# EAGLE design playpad_hub (EAGLE 5.10)
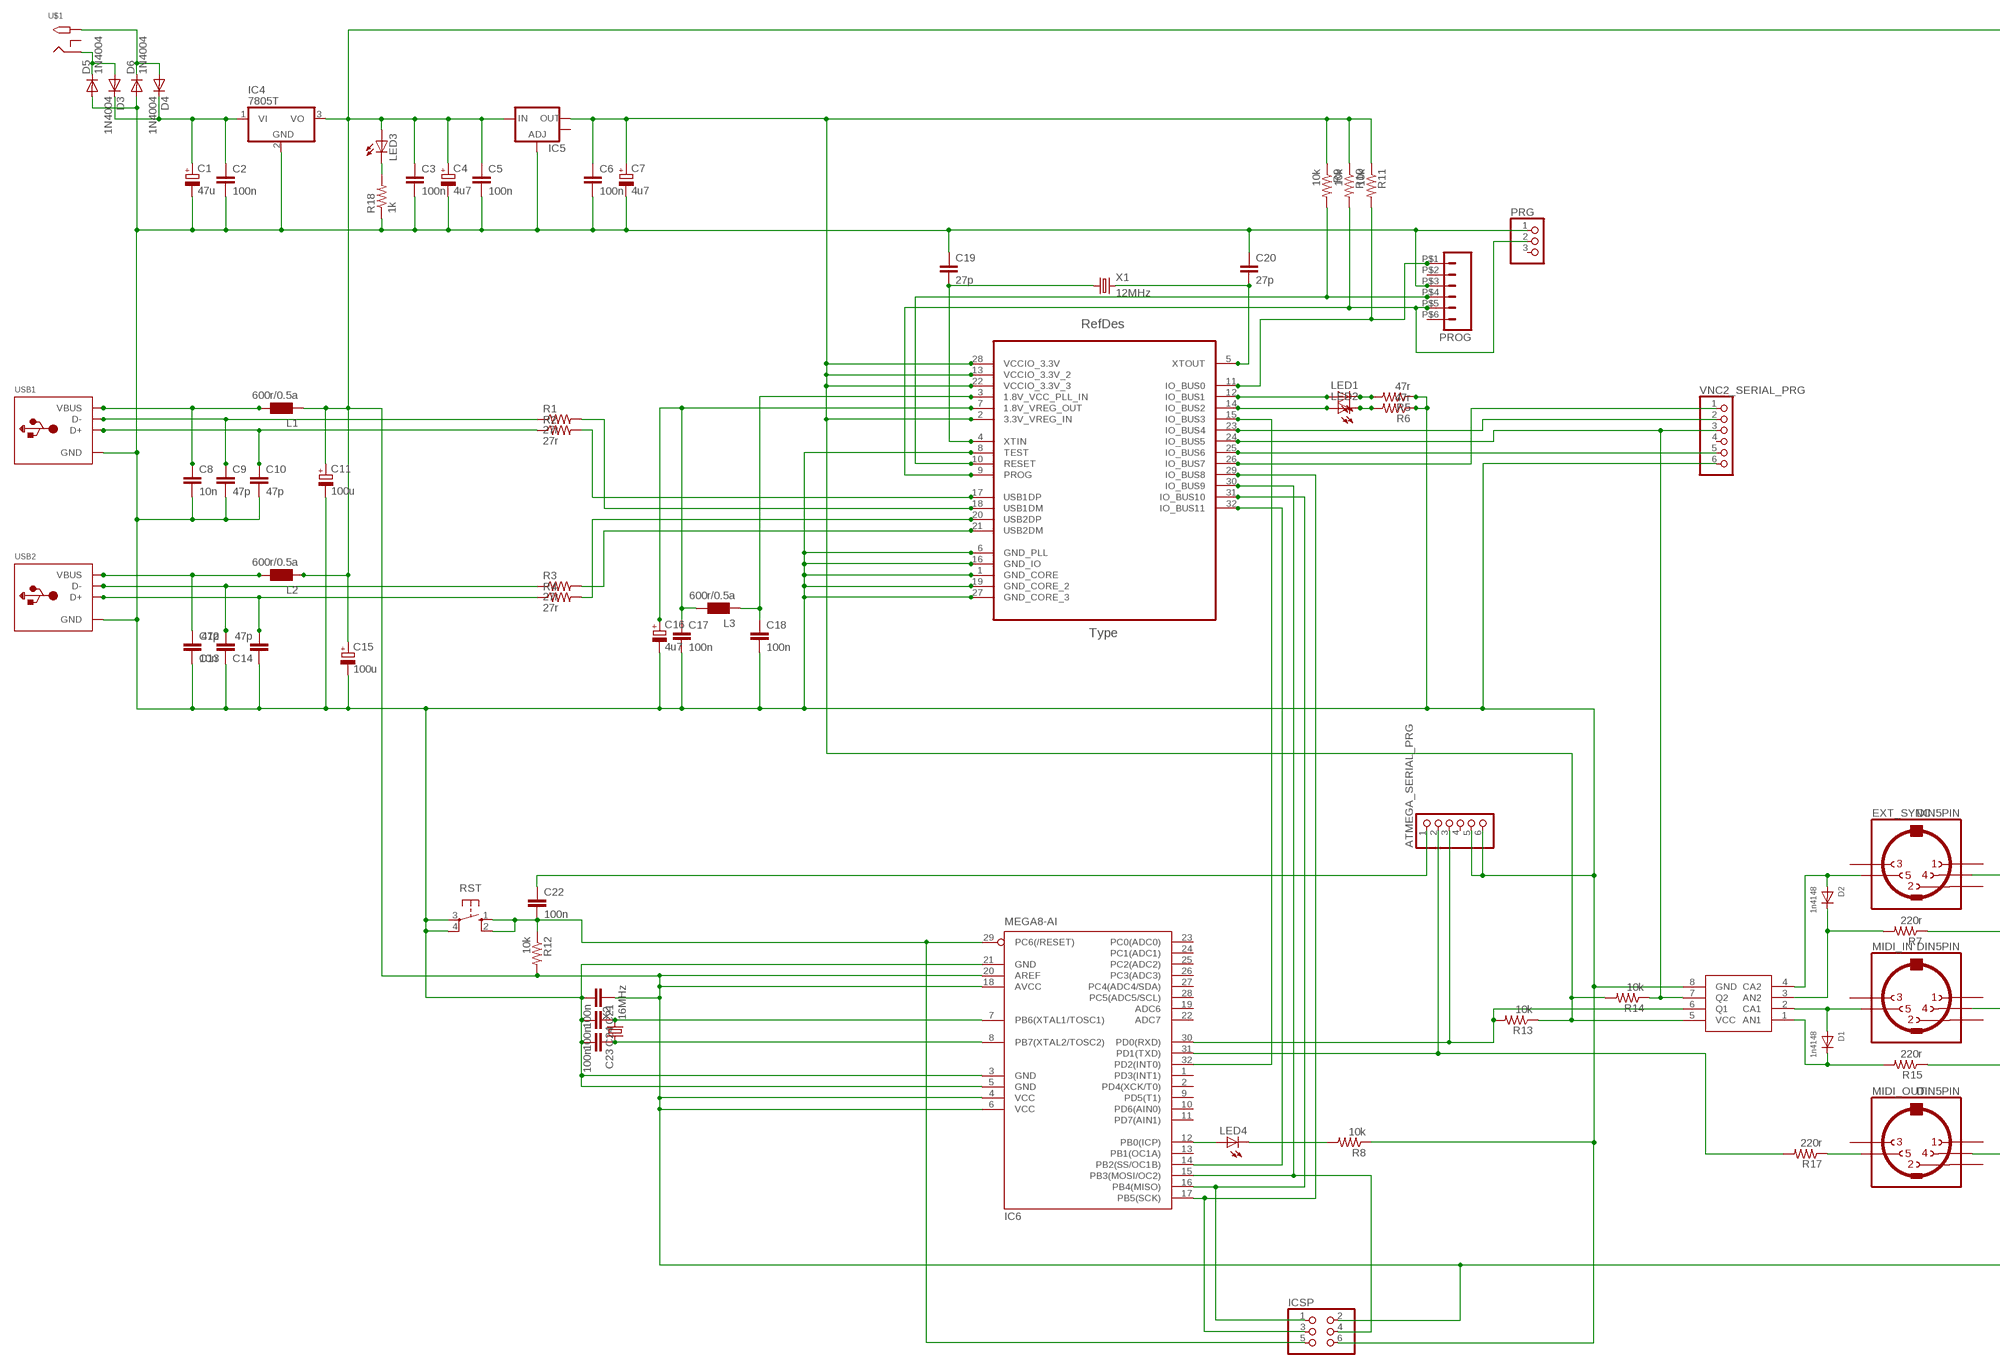
[diagram p0: schematic, sheet 1, part 1 of 2]
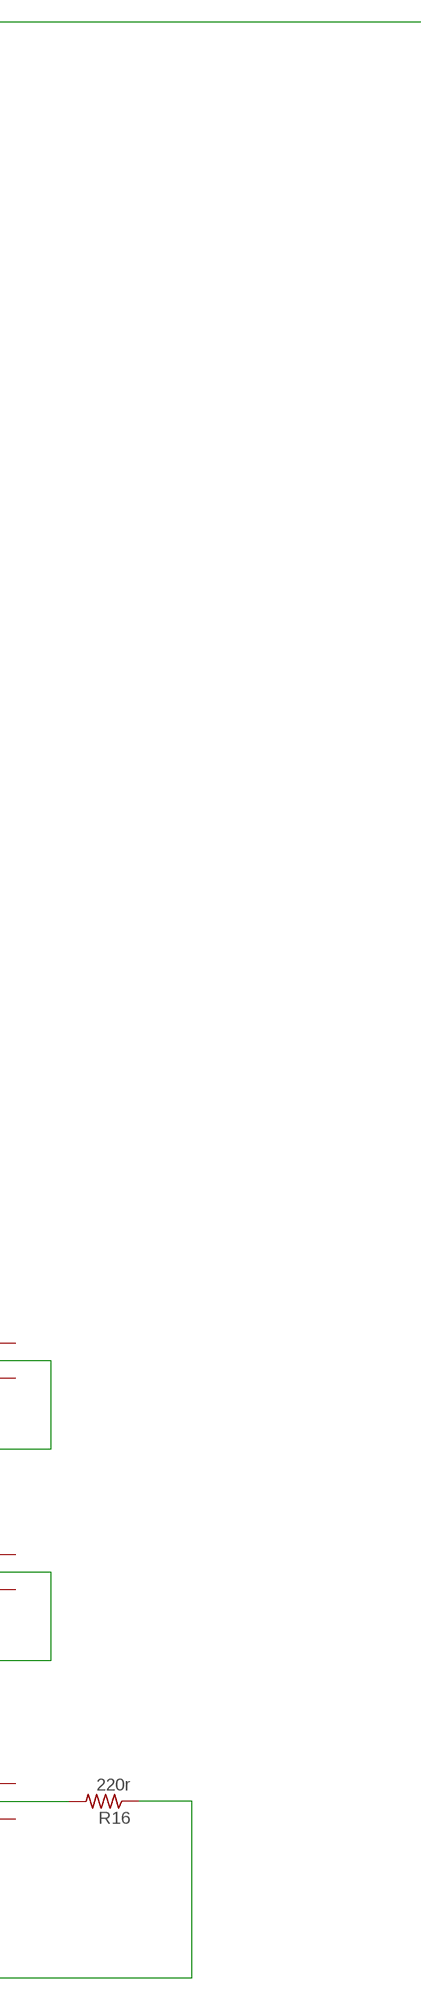
[diagram p1: schematic, sheet 1, part 2 of 2]

## Parts
ATMEGA_SERIAL_PRG  PINHD-1X6  [1X06]
C1  47u  CPOL-EUA/3216-18W  [A/3216-18W]
C2  100n  C-EUC0805  [C0805]
C3  100n  C-EUC0805  [C0805]
C4  4u7  CPOL-EUA/3216-18W  [A/3216-18W]
C5  100n  C-EUC0805  [C0805]
C6  100n  C-EUC0805  [C0805]
C7  4u7  CPOL-EUA/3216-18W  [A/3216-18W]
C8  10n  C-EUC0805  [C0805]
C9  47p  C-EUC0805  [C0805]
C10  47p  C-EUC0805  [C0805]
C11  100u  CPOL-EUE2.5-6  [E2,5-6]
C12  10n  C-EUC0805  [C0805]
C13  47p  C-EUC0805  [C0805]
C14  47p  C-EUC0805  [C0805]
C15  100u  CPOL-EUE2.5-6  [E2,5-6]
C16  4u7  CPOL-EUA/3216-18W  [A/3216-18W]
C17  100n  C-EUC0805  [C0805]
C18  100n  C-EUC0805  [C0805]
C19  27p  C-EUC0805  [C0805]
C20  27p  C-EUC0805  [C0805]
C21  100n  C-EUC0805  [C0805]
C22  100n  C-EUC0805  [C0805]
C23  100n  C-EUC0805  [C0805]
C24  100n  C-EUC0805  [C0805]
D1  1n4148  DIODESOD-123  [SOD-123]
D2  1n4148  DIODESOD-123  [SOD-123]
D3  1N4004  [DO-VERT]
D4  1N4004  [DO-VERT]
D5  1N4004  [DO-VERT]
D6  1N4004  [DO-VERT]
EXT_SYNC  DIN5PIN  [CHEAPYDIN]
IC1  VNC2-32L1B  [QFP80P900X900X160-33N]
IC2  FOD053  [SO08]
IC4  7805T  [TO220H]
IC5  V_REG_LM1117SOT223  [SOT223]
IC6  MEGA8-AI  [TQFP32-08]
ICSP  PINHD-2X3  [2X03]
L1  600r/0.5a  WE-CBF_0805  [0805]
L2  600r/0.5a  WE-CBF_0805  [0805]
L3  600r/0.5a  WE-CBF_0805  [0805]
LED1  LED3MM  [LED3MM]
LED2  LED3MM  [LED3MM]
LED3  LED3MM  [LED3MM]
LED4  LED3MM  [LED3MM]
MIDI_IN  DIN5PIN  [CHEAPYDIN]
MIDI_OUT  DIN5PIN  [CHEAPYDIN]
PRG  HEADER-1X3ROUND  [1X03_ROUND]
PROG  M06  [MA062MM]
R1  27r  R-US_R0805  [R0805]
R2  27r  R-US_R0805  [R0805]
R3  27r  R-US_R0805  [R0805]
R4  27r  R-US_R0805  [R0805]
R5  47r  R-US_R0805  [R0805]
R6  47r  R-US_R0805  [R0805]
R7  220r  R-US_R0805  [R0805]
R8  10k  R-US_R0805  [R0805]
R9  10k  R-US_R0805  [R0805]
R10  10k  R-US_R0805  [R0805]
R11  10k  R-US_R0805  [R0805]
R12  10k  R-US_R0805  [R0805]
R13  10k  R-US_R0805  [R0805]
R14  10k  R-US_R0805  [R0805]
R15  220r  R-US_R0805  [R0805]
R16  220r  R-US_R0805  [R0805]
R17  220r  R-US_R0805  [R0805]
R18  1k  R-US_R0805  [R0805]
RST  10-XX  [B3F-10XX]
U$1  2.1MMJACKTHM  [PJ-102A]
USB1  USB_TYPEAPTHFML  [USB_HOST-PTH]
USB2  USB_TYPEAPTHFML  [USB_HOST-PTH]
VNC2_SERIAL_PRG  PINHD-1X6  [1X06]
X1  12MHz  CRYSTALHC49S  [HC49/S]
X2  16MHz  CRYSTALHC49S  [HC49/S]

## Nets
3V3: C6.1 C7.+ IC1.2(3.3V_VREG_IN) IC1.13(VCCIO_3.3V_2) IC1.22(VCCIO_3.3V_3) IC1.28(VCCIO_3.3V) IC2.5(VCC) IC5.2(OUT) R9.1 R10.1 R11.1 R13.1 R14.2
5V: C3.1 C4.+ C5.1 C11.+ C15.+ C21.1 IC4.3(VO) IC5.3(IN) IC6.4(VCC) IC6.6(VCC) IC6.18(AVCC) IC6.20(AREF) ICSP.2 L1.1 L2.1 LED3.A R12.2 R16.1
GND: ATMEGA_SERIAL_PRG.5 ATMEGA_SERIAL_PRG.6 C1.- C2.2 C3.2 C4.- C5.2 C6.2 C7.- C8.2 C9.2 C10.2 C11.- C12.2 C13.1 C14.1 C15.- C16.- C17.2 C18.2 C19.1 C20.1 C21.2 C23.2 C24.2 D5.A D6.A IC1.1(GND_CORE) IC1.6(GND_PLL) IC1.8(TEST) IC1.16(GND_IO) IC1.19(GND_CORE_2) IC1.27(GND_CORE_3) IC2.8(GND) IC4.2(GND) IC5.1(ADJ) IC6.3(GND) IC6.5(GND) IC6.21(GND) ICSP.6 PRG.1 PROG.P$3 R5.1 R6.1 R8.1 R18.1 RST.3(P) RST.4(P1) USB1.GND USB2.GND VNC2_SERIAL_PRG.6
MIDI_SYNCH_IN: IC1.24(IO_BUS5) IC2.7(Q2) R14.1 VNC2_SERIAL_PRG.3
N$1: C18.1 IC1.3(1.8V_VCC_PLL_IN) L3.1
N$2: IC1.12(IO_BUS1) LED1.A
N$3: LED3.K(C) R18.2
N$4: IC1.14(IO_BUS2) LED2.A
N$5: C24.1 IC6.7(PB6(XTAL1/TOSC1)) X2.2
N$6: C23.1 IC6.8(PB7(XTAL2/TOSC2)) X2.1
N$7: C22.2 IC6.29(PC6(/RESET)) ICSP.5 R12.1 RST.1(S) RST.2(S1)
N$8: C8.1 L1.2 USB1.VBUS
N$9: LED1.K(C) R5.2
N$10: LED2.K(C) R6.2
N$11: IC1.23(IO_BUS4) VNC2_SERIAL_PRG.2
N$12: C14.2 R4.1 USB2.D+
N$13: C13.2 R3.1 USB2.D-
N$14: C10.1 R2.1 USB1.D+
N$15: C9.1 R1.1 USB1.D-
N$16: ATMEGA_SERIAL_PRG.1 C22.1
N$18: D2.A EXT_SYNC.5 IC2.4(CA2)
N$19: C12.1 L2.2 USB2.VBUS
N$20: EXT_SYNC.4 R7.1
N$21: D2.C IC2.3(AN2) R7.2
N$22: IC1.11(IO_BUS0) PROG.P$1 R11.2
N$23: MIDI_OUT.5 R17.1
N$24: ATMEGA_SERIAL_PRG.3 IC2.6(Q1) IC6.30(PD0(RXD)) R13.2
N$25: D3.A D5.C U$1.RING
N$26: D1.A IC2.2(CA1) MIDI_IN.5
N$27: D4.A D6.C U$1.TIP
N$28: ATMEGA_SERIAL_PRG.2 IC6.31(PD1(TXD)) R17.2
N$30: IC1.25(IO_BUS6) VNC2_SERIAL_PRG.5
N$31: IC1.26(IO_BUS7) VNC2_SERIAL_PRG.1
N$32: IC1.29(IO_BUS8) IC6.17(PB5(SCK)) ICSP.3
N$33: D1.C IC2.1(AN1) R15.2
N$34: MIDI_IN.4 R15.1
N$35: IC1.31(IO_BUS10) IC6.16(PB4(MISO)) ICSP.1
N$36: IC1.30(IO_BUS9) IC6.15(PB3(MOSI/OC2)) ICSP.4
N$37: IC1.32(IO_BUS11) IC6.14(PB2(SS/OC1B))
N$38: IC1.15(IO_BUS3) IC6.32(PD2(INT0))
N$39: IC6.12(PB0(ICP)) LED4.A
N$40: LED4.K(C) R8.2
N$42: C16.+ C17.1 IC1.7(1.8V_VREG_OUT) L3.2
N$55: MIDI_OUT.4 R16.2
PROG: IC1.9(PROG) PRG.2 PROG.P$5 R10.2
RESET: IC1.10(RESET) PROG.P$4 R9.2
USB1DM: IC1.18(USB1DM) R1.2
USB1DP: IC1.17(USB1DP) R2.2
USB2DM: IC1.21(USB2DM) R3.2
USB2DP: IC1.20(USB2DP) R4.2
VIN: C1.+ C2.1 D3.C D4.C IC4.1(VI)
XTIN: C19.2 IC1.4(XTIN) X1.1
XTOUT: C20.2 IC1.5(XTOUT) X1.2
Unconnected: ATMEGA_SERIAL_PRG.4 EXT_SYNC.1 EXT_SYNC.2 EXT_SYNC.3 IC5.4(OUT) IC6.1(PD3(INT1)) IC6.2(PD4(XCK/T0)) IC6.9(PD5(T1)) IC6.10(PD6(AIN0)) IC6.11(PD7(AIN1)) IC6.13(PB1(OC1A)) IC6.19(ADC6) IC6.22(ADC7) IC6.23(PC0(ADC0)) IC6.24(PC1(ADC1)) IC6.25(PC2(ADC2)) IC6.26(PC3(ADC3)) IC6.27(PC4(ADC4/SDA)) IC6.28(PC5(ADC5/SCL)) MIDI_IN.1 MIDI_IN.2 MIDI_IN.3 MIDI_OUT.1 MIDI_OUT.2 MIDI_OUT.3 PRG.3 PROG.P$2 PROG.P$6 U$1.RING_SW VNC2_SERIAL_PRG.4

## Library data of the parts
ATMEGA_SERIAL_PRG VNC2_SERIAL_PRG = pinhead:PINHD-1X6: PIN HEADER
C1 C4 C7 C11 C15 C16 = rcl:CPOL-EU: POLARIZED CAPACITOR, European symbol
C2 C3 C5 C6 C8-C10 C12-C14 C17-C24 = rcl:C-EU: CAPACITOR, European symbol
D1 D2 = adafruit:DIODE: Diode SMADIODE - SMA Surface Mount Package 20V 1A Schottky Diode Digikey: 641-1014-6-ND DO-1N4148 - Through Hole Small Current Diode SOD-123 20V 1 A (.5mV Vf) Schottky Diode - Digikey: MBRX120TPMSCT-ND SOD-323 10V 570mA (.38mV Vf, 3ns) Schottky Diode - Digikey: ZLLS410CT-ND SOD-523 30V 30mA Schottky Diode (RB751S-40TE61) - Digikey: RB751S-40TE61CT-ND SOT23-R/W - SOT23 Package (R = Solder Paste/Reflow Ovens, W = Hand-Soldering) BAT54Film 40V 300mA - Digikey: 497-7162-1-ND
D3-D6 = jasons_stuff:1N4004: DIODE general purpose rectifier, 1 A
EXT_SYNC MIDI_IN MIDI_OUT = jasons_stuff:DIN5PIN: Female CONNECTOR 5 pins 90 deg. with shield, horizontal (DIN 41524)
IC1 = farnell_downloads:VNC2-32L1B: Embedded Dual USB Host Controller; DESCRIPTION: Embedded Dual USB Host Controller; MPN: VNC2-32L1B; OC_FARNELL: 1863854; OC_NEWARK: 27T5918; PACKAGE: QFP-32; SUPPLIER: FTDI
IC2 = jasons_stuff:FOD053
IC4 = linear:78*: Positive VOLTAGE REGULATOR Source: http://cache.national.com/ds/LM/LM78L05.pdf http://www.fairchildsemi.com/ds/LM/LM7805.pdf
IC5 = SparkFun:V_REG_LM1117: Voltage Regulator LM1117 Standard adjustable voltage regulator but in SMD form. Spark Fun Electronics SKU : COM-00595
IC6 = atmel:MEGA8: MICROCONTROLLER 8 Kbytes FLASH, 1 kbytes SRAM, 512 bytes EEPROM, USART, 6-channel 10 bit ADC, 2-channel 8 bit ADC Pin compatible with Atmega48, ATMega88, ATMega168 Source: avr.lbr
ICSP = pinhead:PINHD-2X3: PIN HEADER
L1-L3 = wuerth-elektronik:WE-CBF: SMD EMI Suppression Ferrite Beads - excellent anti-EMI properties - low DCR - impedances till 3000 ohms - rated current up to 6 A
LED1-LED4 = led:LED: LED OSRAM: - CHIPLED LG R971, LG N971, LY N971, LG Q971, LY Q971, LO R971, LY R971 LH N974, LH R974 LS Q976, LO Q976, LY Q976 LO Q996 - Hyper CHIPLED LW Q18S LB Q993, LB Q99A, LB R99A - SideLED LS A670, LO A670, LY A670, LG A670, LP A670 LB A673, LV A673, LT A673, LW A673 LH A674 LY A675 LS A676, LA A676, LO A676, LY A676, LW A676 LS A679, LY A679, LG A679 - Hyper Micro SIDELED® LS Y876, LA Y876, LO Y876, LY Y876 LT Y87S - SmartLED LW L88C, LW L88S LB L89C, LB L89S, LG L890 LS L89K, LO L89K, LY L89K LS L896, LA L896, LO L896, LY L896 - TOPLED LS T670, LO T670, LY T670, LG T670, LP T670 LSG T670, LSP T670, LSY T670, LOP T670, LYG T670 LG T671, LOG T671, LSG T671 LB T673, LV T673, LT T673, LW T673 LH T674 LS T676, LA T676, LO T676, LY T676, LB T676, LH T676, LSB T676, LW T676 LB T67C, LV T67C, LT T67C, LS T67K, LO T67K, LY T67K, LW E67C LS E67B, LA E67B, LO E67B, LY E67B, LB E67C, LV E67C, LT E67C LW T67C LS T679, LY T679, LG T679 LS T770, LO T770, LY T770, LG T770, LP T770 LB T773, LV T773, LT T773, LW T773 LH T774 LS E675, LA E675, LY E675, LS T675 LS T776, LA T776, LO T776, LY T776, LB T776 LHGB T686 LT T68C, LB T68C - Hyper Mini TOPLED® LB M676 - Mini TOPLED Santana® LG M470 LS M47K, LO M47K, LY M47K Source: http://www.osram.convergy.de LUXEON: - LUMILED® LXK2-PW12-R00, LXK2-PW12-S00, LXK2-PW14-U00, LXK2-PW14-V00 LXK2-PM12-R00, LXK2-PM12-S00, LXK2-PM14-U00 LXK2-PE12-Q00, LXK2-PE12-R00, LXK2-PE12-S00, LXK2-PE14-T00, LXK2-PE14-U00 LXK2-PB12-K00, LXK2-PB12-L00, LXK2-PB12-M00, LXK2-PB14-N00, LXK2-PB14-P00, LXK2-PB14-Q00 LXK2-PR12-L00, LXK2-PR12-M00, LXK2-PR14-Q00, LXK2-PR14-R00 LXK2-PD12-Q00, LXK2-PD12-R00, LXK2-PD12-S00 LXK2-PH12-R00, LXK2-PH12-S00 LXK2-PL12-P00, LXK2-PL12-Q00, LXK2-PL12-R00 Source: www.luxeon.com KINGBRIGHT: KA-3528ASYC Source: www.kingbright.com
PRG = microbuilder:HEADER-1X3: PIN HEADER
PROG = jasons_stuff:M06: Header 6 Standard 6-pin 0.1" header. Use with straight break away headers (SKU : PRT-00116), right angle break away headers (PRT-00553), swiss pins (PRT-00743), machine pins (PRT-00117), and female headers (PRT-00115). Molex polarized connector foot print use with SKU : PRT-08094 with associated crimp pins and housings. NOTES ON THE VARIANTS LOCK and LOCK_LONGPADS... This footprint was designed to help hold the alignment of a through-hole component (i.e. 6-pin header) while soldering it into place. You may notice that each hole has been shifted either up or down by 0.005 of an inch from it's more standard position (which is a perfectly straight line). This slight alteration caused the pins (the squares in the middle) to touch the edges of the holes. Because they are alternating, it causes a "brace" to hold the component in place. 0.005 has proven to be the perfect amount of "off-center" position when using our standard breakaway headers. Although looks a little odd when you look at the bare footprint, once you have a header in there, the alteration is very hard to notice. Also, if you push a header all the way into place, it is covered up entirely on the bottom side. This idea of altering the position of holes to aid alignment will be further integrated into the Sparkfun Library for other footprints. It can help hold any component with 3 or more connection pins.
R1-R18 = adafruit:R-US_: RESISTOR, American symbol
RST = switch-omron:10-XX: OMRON SWITCH
U$1 = adafruit:2.1MMJACK: 2.1mm x 5.5mm THM DC jack with internal switch. Digikey part #PJ-102A, 4UCON part #05537 2.1mm x 5.5mm SMT DC jack with internal switch. Digikey part #PJ-002A-SMT, 4UCON part #03267 By microbuilder.eu & adafruit.com
USB1 USB2 = microbuilder:USB_TYPEA: USB - Type A Connectors SMT Male - 4UCON: 10017 PTH Female - ???
X1 X2 = crystal:CRYSTAL: CRYSTAL

## Board
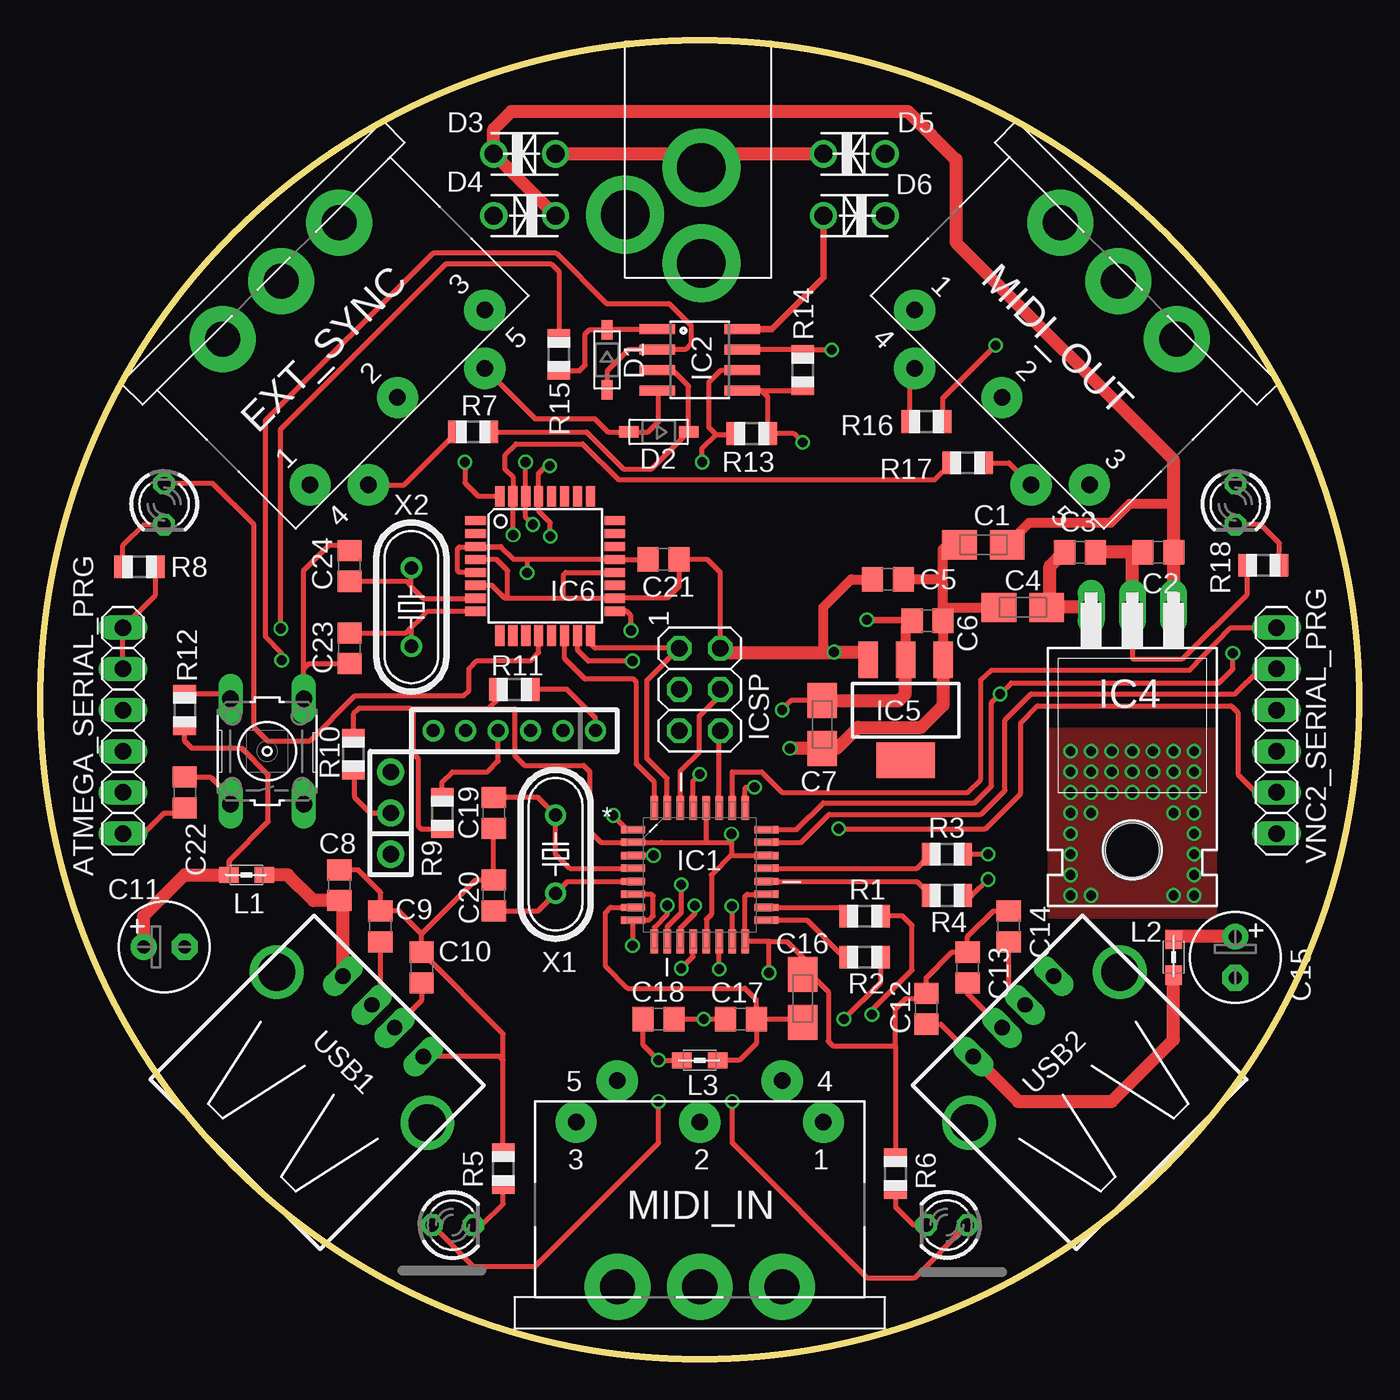
[diagram p2: board, top side]
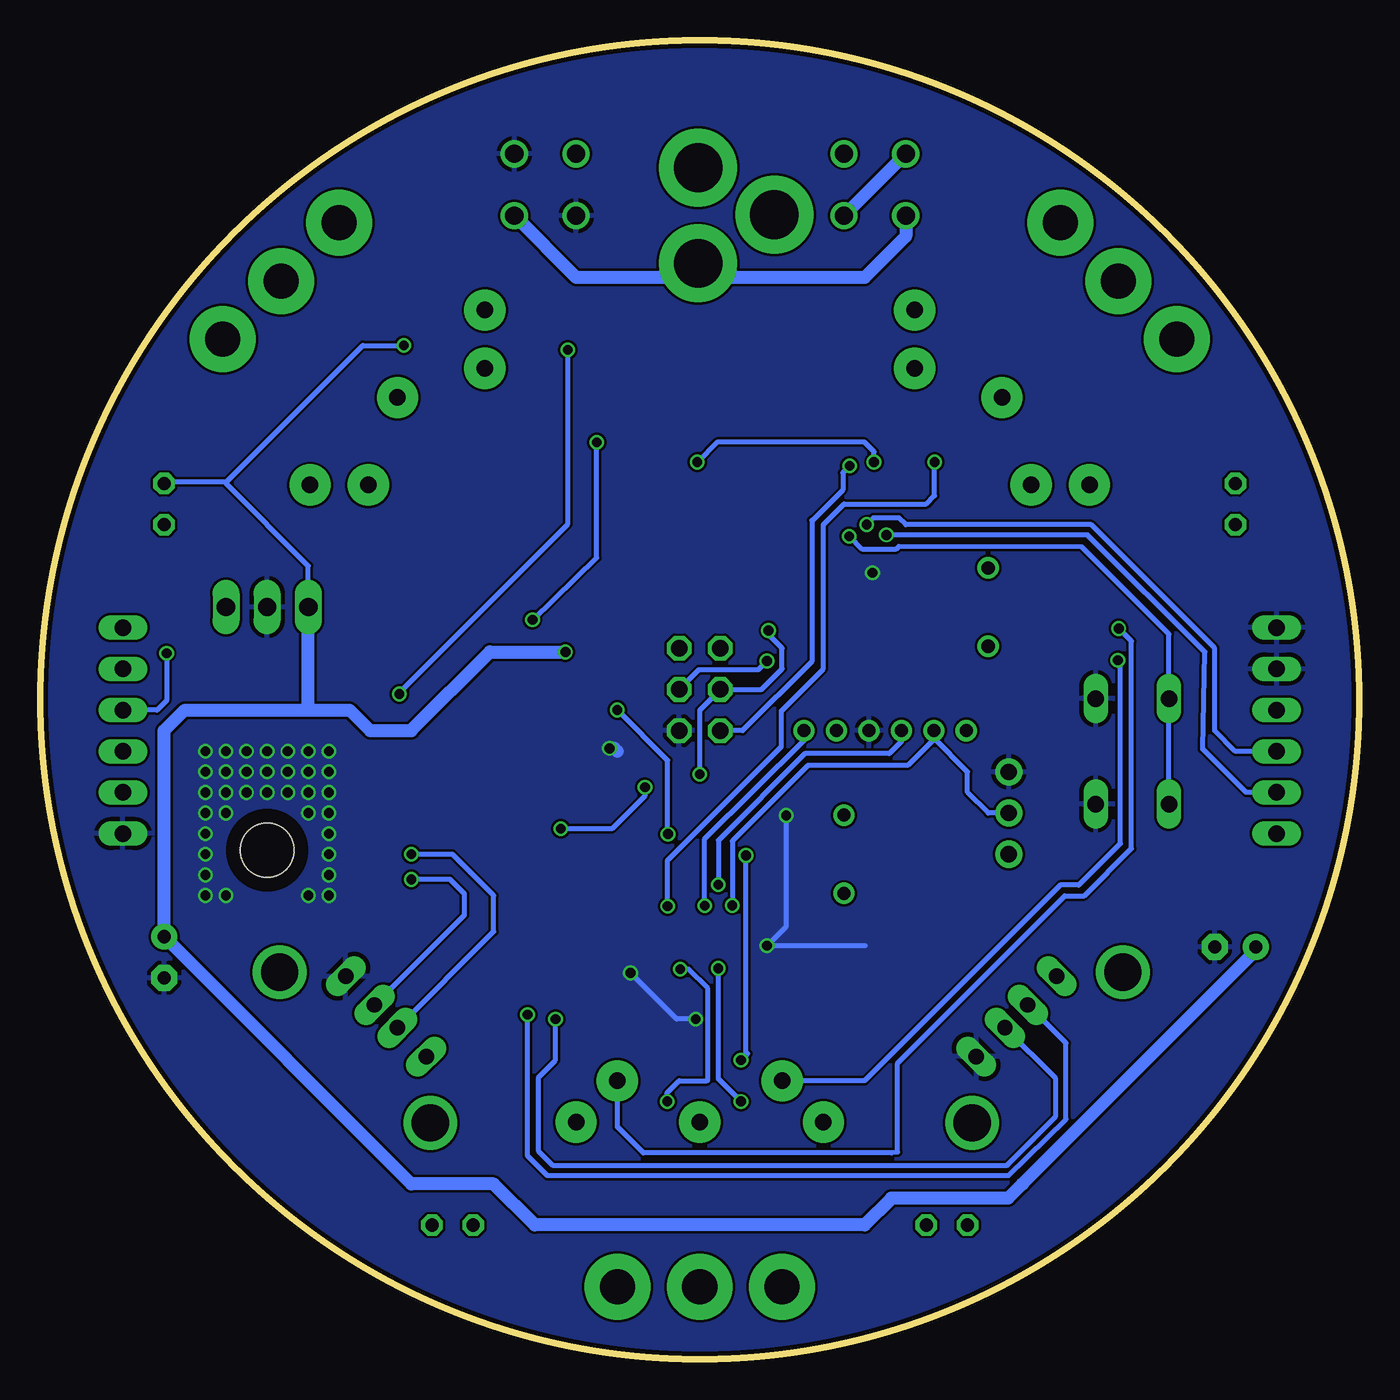
[diagram p3: board, bottom side, seen from below]

Size 81.28 x 81.28 mm. Coordinates in mm from the lower left corner, seen from the top.
Outline: circle at 40.64,40.64 radius 40.64
Copper layers (1*16): Top 0.035mm / dielectric 1.5mm / Bottom 0.035mm
Design rules "ITEADstudio_DRC": minimum track width 6mil, minimum drill 12mil, track to track 6mil, track to pad 6mil, pad to pad 6mil, via to via 6mil, smd to smd 0mil, copper to edge 10mil, drill to drill 10mil, minimum pad ring 10mil, minimum via ring 6mil, stop-mask expansion 2mil, vias tented up to drill 100mil, thermal gap 10mil

### Footprints (pad centres in the part's own frame; a part is rotated, then mirrored left to right if it is on the bottom)
1X06 = drill 1.016 long: 1 -6.35,0; 2 -3.81,0; 3 -1.27,0; 4 1.27,0; 5 3.81,0; 6 6.35,0
A/3216-18W = smd 2.15 x 1.8: + 1.475,0; - -1.475,0
C0805 = smd 1.3 x 1.5: 1 -0.95,0; 2 0.95,0
E2,5-6 = drill 0.813 pad 1.6 round: + -1.27,0 | drill 0.813 pad 1.6 octagon: - 1.27,0
SOD-123 = smd 1.2 x 0.7: A 1.85,0; C -1.85,0
DO-VERT = drill 1.118 round: A 2.54,0; C -1.27,0
CHEAPYDIN = drill 1.016 pad 2.54 round: 1 7.62,5.08; 2 0,5.08; 3 -7.62,5.08; 4 5.08,7.62; 5 -5.08,7.62 | drill 2.159 pad 4.064 round: NC -5.08,-5.08; NC1 0,-5.08; NC2 5.08,-5.08
QFP80P900X900X160-33N = smd 1.473 x 0.457: 1 -4.115,2.794; 2 -4.115,2.007; 3 -4.115,1.194; 4 -4.115,0.406; 5 -4.115,-0.406; 6 -4.115,-1.194; 7 -4.115,-2.007; 8 -4.115,-2.794; 17 4.115,-2.794; 18 4.115,-2.007; 19 4.115,-1.194; 20 4.115,-0.406; 21 4.115,0.406; 22 4.115,1.194; 23 4.115,2.007; 24 4.115,2.794 | smd 0.457 x 1.473: 9 -2.794,-4.115; 10 -2.007,-4.115; 11 -1.194,-4.115; 12 -0.406,-4.115; 13 0.406,-4.115; 14 1.194,-4.115; 15 2.007,-4.115; 16 2.794,-4.115; 25 2.794,4.115; 26 2.007,4.115; 27 1.194,4.115; 28 0.406,4.115; 29 -0.406,4.115; 30 -1.194,4.115; 31 -2.007,4.115; 32 -2.794,4.115
SO08 = smd 0.61 x 2.21: 1 -1.905,-2.616; 2 -0.635,-2.616; 3 0.635,-2.616; 4 1.905,-2.616; 5 1.905,2.616; 6 0.635,2.616; 7 -0.635,2.616; 8 -1.905,2.616
TO220H = drill 1.118 long: 1 -2.54,-10.16; 2 0,-10.16; 3 2.54,-10.16 | hole 3.302: 0,4.826
SOT223 = smd 1.219 x 2.235: 1 -2.311,-3.099; 2 0,-3.099; 3 2.311,-3.099 | smd 3.6 x 2.2: 4 0,3.099
TQFP32-08 = smd 1.27 x 0.559: 1 -4.293,2.8; 2 -4.293,2; 3 -4.293,1.2; 4 -4.293,0.4; 5 -4.293,-0.4; 6 -4.293,-1.2; 7 -4.293,-2; 8 -4.293,-2.8; 17 4.293,-2.8; 18 4.293,-2; 19 4.293,-1.2; 20 4.293,-0.4; 21 4.293,0.4; 22 4.293,1.2; 23 4.293,2; 24 4.293,2.8 | smd 0.559 x 1.27: 9 -2.8,-4.293; 10 -2,-4.293; 11 -1.2,-4.293; 12 -0.4,-4.293; 13 0.4,-4.293; 14 1.2,-4.293; 15 2,-4.293; 16 2.8,-4.293; 25 2.8,4.293; 26 2,4.293; 27 1.2,4.293; 28 0.4,4.293; 29 -0.4,4.293; 30 -1.2,4.293; 31 -2,4.293; 32 -2.8,4.293
2X03 = drill 1.016 octagon: 1 -2.54,-1.27; 2 -2.54,1.27; 3 0,-1.27; 4 0,1.27; 5 2.54,-1.27; 6 2.54,1.27
0805 = smd 1.2 x 1: 1 -1.1,0; 2 1.1,0
LED3MM = drill 0.813 octagon: A -1.27,0; K 1.27,0
1X03_ROUND = drill 1 pad 1.676 round: 1 -2.54,0; 2 0,0; 3 2.54,0
MA062MM = drill 0.8 round: P$1 -5,0; P$2 -3,0; P$3 -1,0; P$4 1,0; P$5 3,0; P$6 5,0
R0805 = smd 1.1 x 1.4: 1 -1,0; 2 1,0
B3F-10XX = drill 1.016 long: 1 -3.251,2.261; 2 3.251,2.261; 3 -3.251,-2.261; 4 3.251,-2.261
PJ-102A = drill 3 pad 4.8 round: RING 0.1,-3.39; RING_SW -4.6,-6.29; TIP 0.1,-9.29
USB_HOST-PTH = drill 0.95 long: D+ 1,6.52; D- -1,6.52; GND 3.5,6.52; VBUS -3.5,6.52 | drill 2.3 pad 2.9 round: S1 -6.57,3.81; S2 6.57,3.81
HC49/S = drill 0.813 round: 1 -2.413,0; 2 2.413,0

### Placement (x,y rotation side)
ATMEGA_SERIAL_PRG  5.08,38.73 90 top
C1  58.12,50.19 0 top
C2  68.91,49.73 180 top
C3  64.08,49.73 0 top
C4  60.55,46.33 0 top
C5  52.25,48.06 0 top
C6  54.69,45.52 0 top
C7  48.18,39.12 90 top
C8  18.42,29.21 90 top
C9  20.96,26.67 90 top
C10  23.5,24.13 90 top
C11  7.62,25.4 0 top
C12  54.61,21.59 90 top
C13  57.15,24.13 270 top
C14  59.69,26.67 270 top
C15  73.66,24.76 270 top
C16  46.99,22.22 270 top
C17  43.18,20.95 180 top
C18  38.1,20.95 0 top
C19  27.94,33.66 90 top
C20  27.94,28.57 270 top
C21  38.4,49.3 180 top
C22  8.89,34.92 90 top
C23  19.05,43.81 270 top
C24  19.05,48.89 90 top
D1  34.93,61.59 270 top
D2  38.1,57.15 180 top
D3  29.21,74.29 0 top
D4  30.48,70.48 180 top
D5  49.53,74.29 0 top
D6  50.8,70.48 180 top
EXT_SYNC  18.42,62.86 225 top
IC1  40.64,29.84 0 top
IC2  40.64,61.59 270 top
IC4  67.31,36.2 180 top
IC5  53.34,40 180 top
IC6  31.12,48.89 0 top
ICSP  40.64,41.27 270 top
L1  12.7,29.84 0 top
L2  69.85,24.76 270 top
L3  40.64,18.41 0 top
LED1  25.4,8.25 0 top
LED2  55.88,8.25 180 top
LED3  73.66,52.7 270 top
LED4  7.62,52.7 270 top
MIDI_IN  40.64,9.52 0 top
MIDI_OUT  62.87,62.86 135 top
PRG  21.59,33.66 270 top
PROG  29.21,38.73 180 top
R1  50.8,27.3 180 top
R2  50.8,24.76 180 top
R3  55.88,31.11 180 top
R4  55.88,28.57 180 top
R5  28.52,11.73 270 top
R6  52.71,11.43 270 top
R7  26.67,57.15 0 top
R8  6.1,48.84 180 top
R9  24.77,33.66 90 top
R10  19.28,37.29 270 top
R11  29.21,41.27 0 top
R12  8.89,40 270 top
R13  43.84,57.05 180 top
R14  46.99,60.96 270 top
R15  31.95,61.93 270 top
R16  54.61,57.78 180 top
R17  57.15,55.24 180 top
R18  75.39,48.92 0 top
RST  13.97,37.46 90 top
U$1  40.64,76.84 0 top
USB1  16.51,16.51 315 top
USB2  64.59,16.51 45 top
VNC2_SERIAL_PRG  76.2,38.73 270 top
X1  31.75,31.11 270 top
X2  22.86,46.35 90 top

### Tracks (layer width: path | path; a pad name or v marks a point on that pad's centre or on a via)
3V3  (via drill 0.6)
  Top 0.305: IC1.13 41.05,27.1 41.35,27.41 41.35,29.84 42.6,31.09 | IC1.22 42.65,31.04 42.6,31.09 | 44.45,59.69 IC2.5 | 44.45,59.69 46.72,59.69 R14.2 | 44.45,59.69 44.84,59.3 R13.1 46.46,57.05 v46.99,56.52 | 42.6,31.83 42.6,31.09 | 42.6,31.83 v42.6,32.36 | 41.15,31.85 42.57,31.85 42.6,31.83 | IC1.2 41.15,31.85 | IC1.28 41.05,31.95 41.15,31.85 | R10.1 19.28,39.75 19.63,40.11 22.81,40.11 | 22.81,40.11 27.61,40.11 27.72,40.22 | 27.72,40.22 28.17,40.66 28.17,41.23 R11.1 | R9.1 23.48,32.66 23.29,32.84 23.29,36.98 22.99,37.29 22.99,39.93 22.81,40.11 | IC1.2 38.3,31.85 | 27.72,40.22 27.87,40.07 29.24,40.07 29.24,37.21 29.85,36.6 33.48,36.6 33.86,36.22 33.86,32.56 34.57,31.85 IC1.2 | C6.1 53.66,45.44 | C7.+ 48.16,40.61 46.3,40.61 45.7,40 v45.72,40
  Top 0.406: v50.95,45.57 53.69,45.57 C6.1
  Top 0.61: IC5.2 53.34,45.12 C6.1
  Top 0.813: C7.+ 52.91,40.59 53.32,41 53.32,43.08 IC5.2
  Bottom 0.305: v42.6,32.36 42.62,32.38 42.62,36.91 v45.72,40 | v46.99,56.52 46.99,49.4 v50.95,45.57
5V  (via drill 0.6)
  Top 0.305: IC6.6 27.83,47.7 28.64,46.89 28.73,46.89 | 32.26,46.89 28.73,46.89 | 32.26,46.89 IC6.18 35.43,46.91 38.66,46.91 39.37,47.62 39.37,49.29 C21.1 | IC6.4 28.1,49.29 28.8,48.59 28.8,46.96 28.73,46.89 | R16.1 55.61,59.22 v58.88,62.48 | R12.2 8.89,38.1 9.35,37.64 12.42,37.64 14.05,36.02 14.05,33.12 11.66,30.73 | 11.66,30.73 11.63,30.71 11.63,29.88 L1.1 | 11.66,30.73 11.66,30.07 11.43,29.84 | IC6.20 32.39,48.49 32.26,48.36 32.26,46.89 | ICSP.2 41.91,48.49 41.12,49.28 39.38,49.28 C21.1 | C21.1 39.36,48.09
  Top 0.406: C3.1 63.07,49.73
  Top 0.61: 11.43,29.84 L1.1 | 63.13,49.67 C3.1 | C4.+ | C5.1 49.96,48.06 48.26,46.35 48.26,43.81 48.49,43.59 v48.92,43.59
  Top 0.813: 11.43,29.84 8.89,29.84 6.35,27.3 C11.+ | C15.+ 70.02,26.03 L2.1 | IC4.3 62.05,46.35 C4.+ 62.23,46.53 62.23,48.89 63.01,49.67 63.13,49.67 | 51.03,43.59 IC5.3 | 51.03,43.59 50.8,43.81 | 51.03,43.59 v48.92,43.59 48.87,43.54 42.19,43.54 ICSP.2
  Bottom 0.305: v58.88,62.48 61.42,62.48 69.85,54.05 | 69.85,54.05 73.58,54.05 | 69.85,54.05 69.85,53.98 64.77,48.89 IC4.3
  Bottom 0.61: IC4.3 64.75,46.33 | 6.62,24.92 6.68,24.82
  Bottom 0.813: 73.58,54.05 LED3.A | 64.77,40 72.39,40 73.66,38.73 C15.+ 58.42,10.79 53.34,10.79 50.8,8.25 30.48,8.25 28.83,9.91 21.64,9.91 20.75,10.79 6.62,24.92 6.35,25.19 C11.+ | 64.77,40 62.23,40 60.96,38.73 58.42,38.73 53.57,43.59 v48.92,43.59 | 64.77,40 IC4.3
GND  (via drill 0.6)
  Top 0.305: C19.1 C20.1 26.81,29.52 23.5,26.21 | IC1.27 41.83,38.66 ICSP.6 | IC1.6 36.5,28.63 37.69,28.63 37.77,28.55 37.77,27.3 37.54,27.08 36.55,27.08 IC1.8 36.53,25.5 v36.5,25.48 | C18.2 v40.89,20.95 C17.2 | 44.96,25.73 IC1.16 43.43,28.52 43.56,28.65 IC1.19 | 44.96,25.73 46.03,25.73 46.99,24.76 46.99,24.21 | 46.99,24.21 C16.- | C8.2 19.57,30.16 20.98,28.75 20.98,27.64 C9.2 22.09,27.62 23.5,26.21 | 23.5,26.21 C10.2 28.52,20.05 28.52,18.41 | R5.1 28.52,18.41 | USB1.GND 28.29,18.64 28.52,18.41 | 52.71,19.33 R6.1 | IC1.1 36.17,32.64 v35.31,33.5 | v44.91,23.8 44.91,25.68 44.96,25.73 | 52.71,19.33 52.73,19.3 48.84,19.3 48.57,19.58 48.57,22.63 46.99,24.21 | ATMEGA_SERIAL_PRG.5 ATMEGA_SERIAL_PRG.6 7.1,47.1 R8.1 | IC6.5 25.83,48.49 25.71,48.62 25.71,49.94 25.83,50.06 26.79,50.06 | 26.79,50.06 IC6.3 28.37,50.09 28.4,50.06 | 29.9,49.3 29.16,49.3 28.4,50.06 | 29.9,49.3 IC6.21 C21.2 | R18.1 74.39,47.13 70.38,43.16 67.34,43.16 67.34,46.33 IC4.2 | 26.79,50.06 28.4,50.06 | v30,48.46 30,49.2 29.9,49.3 | RST.4 16.23,42.54 | 16.23,42.54 16.23,48.62 17.78,50.16 18.73,50.16 C24.2 | C23.2 16.55,42.86 16.23,42.54 | C14.1 58.73,27.62 57.15,26.03 C13.1 56.2,25.08 54.61,23.49 C12.2 54.3,22.22 53.34,22.22 52.71,21.59 52.71,19.33
  Top 0.406: IC2.8 45.09,63.5 48.26,66.68 D6.A
  Top 0.61: C6.2 55.64,46.35 | 55.64,46.35 55.64,47.72 55.63,47.73 | C5.2 55.3,48.06 55.63,47.73 | IC5.1 55.65,45.5 C6.2 | C6.2 55.66,45.49 | 55.63,47.73 55.63,49.91 55.88,50.16 56.62,50.16 C1.- | C7.- | C4.- 55.66,46.33 55.64,46.35
  Top 0.813: 67.31,49.73 C3.2 | 67.31,49.73 C2.2 | IC4.2 67.31,49.73 | IC5.1 55.65,40.31 54.28,38.94 50.39,38.94 49.1,37.64 C7.- v46.2,37.64
  Bottom 0.305: 30.43,25.48 v36.5,25.48 35.31,26.67 v35.31,33.5 | v40.89,20.95 42.06,20.95 v44.91,23.8
  Bottom 0.813: v46.2,37.64 45.9,37.64 45.72,37.46
  other vias: 63.5,36.2 64.77,36.2 66.04,36.2 67.31,36.2 68.58,36.2 69.85,36.2 71.12,36.2 63.5,37.46 64.77,37.46 66.04,37.46 67.31,37.46 68.58,37.46 69.85,37.46 71.12,37.46 63.5,34.92 63.5,33.66 63.5,32.38 63.5,31.11 63.5,29.84 63.5,28.57 64.77,28.57 69.85,28.57 71.12,28.57 71.12,29.84 71.12,31.11 71.12,32.38 71.12,33.66 71.12,34.92 64.77,34.92 69.85,34.92 66.04,34.92 67.31,34.92 68.58,34.92 64.77,33.66 69.85,33.66
  pour Bottom: -3.81,83.19 85.09,83.19 85.09,-0.64 -3.81,-0.64
  pour Top: 62.23,38.73 62.23,27.3 72.39,27.3 72.39,38.73
MIDI_SYNCH_IN  (via drill 0.6)
  Top 0.305: IC2.7 46.72,62.23 R14.1 47.24,62.2 v48.77,62.2 | v73.51,43.51 73.51,42.54 72.64,41.68 59.84,41.68 v59.16,41 58.62,40.46 58.62,35.33 57.58,34.29 48.26,34.29 46.61,32.64 IC1.24
  Bottom 0.305: v59.16,41 59.16,41.1 48.77,51.49 v48.77,62.2 | v73.51,43.51 73.51,40.59 74.09,40 VNC2_SERIAL_PRG.3
N$1  (via drill 0.6)
  Top 0.305: C18.1 37.15,19.36 v38.1,18.41 L3.1 | v37.8,31.04 IC1.3
  Bottom 0.305: v38.1,18.41 38.15,18.47 | v38.1,18.41 37.69,18.82 | v37.8,31.04 37.8,18.72 v38.1,18.41
N$2  (via drill 0.6)
  Top 0.305: IC1.12 40.23,24.82 v39.5,24.08 | v38.1,15.87 38.1,13.33 30.48,5.71 26.67,5.71 LED1.A
  Bottom 0.305: v39.5,24.08 39.5,17.27 v38.1,15.87
N$3
  Top 0.305: LED3.K 75.23,51.43 76.38,50.29 76.38,48.93 R18.2
N$4  (via drill 0.6)
  Top 0.305: v41.83,24.03 IC1.14 | v42.65,15.87 42.65,13.31 50.95,5 53.9,5 LED2.A
  Bottom 0.305: v41.83,24.03 41.33,24.03 40.13,22.83 40.13,17.2 40.18,17.14 41.91,17.14 42.65,16.41 v42.65,15.87
N$5
  Top 0.305: IC6.7 23.59,46.89 22.86,47.62 | 22.86,47.62 X2.2 | C24.1 22.54,47.95 22.86,47.62
N$6
  Top 0.305: IC6.8 23.87,46.09 23.5,45.72 22.86,45.09 | 22.86,45.09 X2.1 | C23.1 22.54,44.77 22.86,45.09
N$7  (via drill 0.6)
  Top 0.305: C22.2 10.48,35.88 11.71,34.65 RST.1 | R12.1 11.42,41 RST.2 | v31.39,55.07 31.19,55.07 30.71,54.59 IC6.29 30.71,52.27 31.42,51.56 v31.42,50.72
  Bottom 0.305: RST.1 RST.2 11.71,44.68 17.09,50.06 28.37,50.09 28.55,49.91 30.61,49.91 v31.42,50.72 | ICSP.5 38,38.73 33.73,43 33.73,51.69 33.71,51.69 31.83,53.57 31.83,54.63 v31.39,55.07
N$8
  Top 0.813: USB1.VBUS 18.65,28.03 C8.1 16.83,28.26 15.24,29.84 L1.2
N$9
  Top 0.305: LED1.K 27.2,8.25 28.52,9.58 R5.2
N$10
  Top 0.305: LED2.K 53.82,8.25 52.71,9.37 R6.2
N$11
  Top 0.305: IC1.23 46.89,31.85 48.62,33.58 57.99,33.58 59.46,35.05 59.46,39.39 61.06,41 73.64,41 75.18,42.54 VNC2_SERIAL_PRG.2
N$12  (via drill 0.6)
  Top 0.305: C14.2 59.69,22.83 USB2.D+ | R4.1 57.43,28.57 v58.42,29.57
  Bottom 0.305: v58.42,29.57 56.03,29.57 55.14,28.68 55.14,27.37 USB2.D+
N$13  (via drill 0.6)
  Top 0.305: C13.2 57.15,22.54 USB2.D- | v58.42,31.11 R3.1
  Bottom 0.305: v58.42,31.11 55.88,31.11 53.34,28.57 53.34,26.35 USB2.D-
N$14  (via drill 0.6)
  Top 0.305: USB1.D+ 21.83,20.46 23.52,22.15 23.52,23.15 C10.1 | R2.1 51.8,23.22 v49.53,20.95
  Bottom 0.305: USB1.D+ 21.79,20.41 21.79,20.39 18.69,17.3 18.69,14.96 21.74,11.91 49.68,11.91 50.57,12.8 50.57,17.37 49.53,18.41 v49.53,20.95
N$15  (via drill 0.6)
  Top 0.305: C9.1 20.96,22.37 USB1.D- | R1.1 53.14,27.3 53.72,26.72 53.72,23.98 51.26,21.51 v51.26,21.23
  Bottom 0.305: v51.26,21.23 51.26,12.52 50.04,11.3 21.64,11.3 18.06,14.78 18.06,19.47 USB1.D-
N$16
  Top 0.305: ATMEGA_SERIAL_PRG.1 6.35,32.38 7.62,33.66 8.57,33.66 C22.1
N$18
  Top 0.305: IC2.4 38.1,59.61 38.1,57.78 37.47,57.15 D2.A 34.98,57.15 34.16,57.96 30.48,57.96 27.4,61.05 EXT_SYNC.5
N$19
  Top 0.305: C12.1 55.51,20.64 USB2.VBUS
  Top 0.813: L2.2 69.85,19.68 66.04,15.87 60.27,15.87 USB2.VBUS
N$20
  Top 0.305: EXT_SYNC.4 22.41,53.88 R7.1
N$21
  Top 0.305: R7.2 33.66,57.15 35.94,54.86 37.66,54.86 D2.C 39.95,59.97 38.96,60.96 IC2.3
N$22  (via drill 0.6)
  Top 0.305: IC1.11 39.45,26.57 40.34,27.46 v40.34,27.94 | R11.2 32.46,41.27 34.01,39.73 34.19,39.55 34.21,39.53 PROG.P$1
  Bottom 0.305: v40.34,27.94 40.34,32.05 34.19,38.15 34.21,38.17 PROG.P$1
N$23
  Top 0.305: R17.1 59.71,55.24 MIDI_OUT.5
N$24  (via drill 0.6)
  Top 0.305: IC2.6 41.94,60.96 41.2,60.22 41.2,57.43 41.63,57 | 41.63,57 42.79,57 R13.2 | IC6.30 29.92,53.18 | IC6.30 29.92,51.87 v30.35,51.43 | v40.79,55.3 40.79,56.16 41.63,57 | IC6.30 29.92,55.28 v29.9,55.3
  Bottom 0.305: ATMEGA_SERIAL_PRG.3 7.62,37.46 8.89,38.73 8.89,43.81 16.51,51.43 27.94,51.43 28.35,51.84 29.95,51.84 v30.35,51.43 | v29.9,55.3 29.9,55.93 30.48,56.52 39.57,56.52 v40.79,55.3
N$25
  Top 0.813: D3.A 39.89,74.29 U$1.RING 41.59,74.29 D5.C
N$26  (via drill 0.6)
  Top 0.305: D1.A 34.93,60.91 36.25,62.23 IC2.2 39.75,62.23 40.11,62.59 40.11,63.7 38.74,65.07 34.9,65.07 31.78,68.2 24.23,68.2 13.87,57.89 13.87,44.53 14.86,43.54 v14.86,43.08
  Bottom 0.305: MIDI_IN.5 30.48,17.14 18.42,29.21 17.27,29.21 14.71,31.77 14.71,42.93 v14.86,43.08
N$27
  Bottom 0.813: D4.A 27.94,69.22 30.48,66.68 39.87,66.68 U$1.TIP 41.04,67.54 41.91,66.68 48.26,66.68 D6.C
N$28  (via drill 0.6)
  Top 0.305: R17.2 55.11,54.2 35.64,54.2 33.43,56.41 29.31,56.41 28.65,55.75 28.65,54.84 29.16,54.33 29.16,53.23 IC6.31 | IC6.31 29.13,53.21 | v29.13,50.8 29.13,53.17 IC6.31
  Bottom 0.305: ATMEGA_SERIAL_PRG.2 6.96,34.92 9.63,37.59 9.5,43.59 16.74,50.8 v29.13,50.8
N$30  (via drill 0.6)
  Top 0.305: IC1.25 43.43,34.27 | 43.43,34.27 43.41,34.29 | VNC2_SERIAL_PRG.5 74.93,34.92 73.81,36.04 73.81,39.85 73.41,40.26 61.47,40.26 60.43,39.22 60.43,34.87 58.24,32.69 v49.2,32.69 | 43.43,34.27 43.43,35.18 43.51,35.25 v44.02,35.25
  Bottom 0.305: v44.02,35.25 44.02,34.72 46.05,32.69 v49.2,32.69
N$31
  Top 0.305: VNC2_SERIAL_PRG.1 73.38,45.09 70.84,42.47 58.62,42.47 57.96,41.88 57.96,35.74 57.15,34.92 45.72,34.92 44.45,36.2 42.65,36.2 IC1.26
N$32  (via drill 0.6)
  Top 0.305: v36.4,44.91 36.4,45.82 36.12,46.1 IC6.17 | IC1.29 40.23,35.64 v40.64,36.04
  Bottom 0.305: v36.4,44.91 36.4,44.65 35.56,43.81 35.56,42.54 36.83,41.27 ICSP.3 40.64,40 40.64,36.2 v40.64,36.04
N$33
  Top 0.305: IC2.1 34.98,63.5 D1.C | D1.C 34.91,63.46 | R15.2 33.24,60.92 33.58,61.27 33.58,63.2 33.83,63.45 D1.C
N$34  (via drill 0.6)
  Top 0.305: v14.81,45.03 14.81,57.33 24.99,67.51 31.47,67.51 31.95,67.03 R15.1
  Bottom 0.305: v14.81,45.03 14.02,44.25 14.02,31.47 16.94,28.55 18.14,28.55 28.45,18.24 28.45,12.75 28.8,12.7 44.12,12.7 45.72,14.3 MIDI_IN.4
N$35
  Top 0.305: IC1.31 38.63,35.79 37.39,37.03 37.39,41.83 ICSP.1 34.19,43.81 33.99,44.02 33.92,44.09 IC6.16
N$36  (via drill 0.6)
  Top 0.305: IC6.15 33.12,43.7 33.78,43.03 v36.5,43.03 | IC1.30 39.45,36.27 40.64,37.46 40.62,37.49 40.62,39.65 41.91,40.95 ICSP.4
  Bottom 0.305: ICSP.4 40.69,42.49 37.03,42.49 v36.5,43.03
N$37
  Top 0.305: IC1.32 37.85,35.56 36.73,36.68 36.73,41.73 36.55,41.91 33.58,41.91 32.31,43.18 IC6.14
N$38  (via drill 0.6)
  Top 0.305: IC1.15 42.65,27.89 v42.62,27.91 | IC6.32 26.98,53.19 26.16,54 v26.16,55.3
  Bottom 0.305: v42.62,27.91 42.62,30.73 35.61,37.74 35.61,39.95 33.02,42.54 33.02,51.43 31.75,52.7 26.67,52.7 26.16,53.21 v26.16,55.3
N$39
  Top 0.305: IC6.12 30.72,43.54 30.23,43.05 26.92,43.05 26.42,42.54 26.42,41.22 26.09,40.89 19.41,40.89 16.61,38.1 14,38.1 13.16,38.94 13.16,51.43 10.62,53.98 LED4.A
N$40
  Top 0.305: LED4.K 6.35,51.43 5.08,50.16 5.08,48.86 R8.2
N$42
  Top 0.305: C17.1 44.12,22.17 43.43,22.86 36.2,22.86 34.82,24.23 34.82,27.51 35.15,27.84 IC1.7 | C17.1 46.79,20.95 C16.+ | C17.1 44.13,19.47 43.08,18.41 L3.2
N$55
  Top 0.305: R16.2 53.61,60.79 MIDI_OUT.4
PROG  (via drill 0.6)
  Top 0.305: IC1.9 37.85,26.62 38.63,27.41 v38.63,27.96 | R10.2 19.37,36.2 19.37,34.6 20.32,33.66 PRG.2
  Bottom 0.305: 26.21,38.27 PROG.P$5 | 26.21,38.27 24.13,36.2 24.13,34.92 22.86,33.66 PRG.2 | 26.21,38.27 26.21,38.2 27.81,36.6 33.96,36.6 38.63,31.93 v38.63,27.96
RESET  (via drill 0.6)
  Top 0.305: IC1.10 38.63,26.64 39.5,27.51 v39.5,29.23 | R9.2 24.77,35.56 25.4,36.2 27.56,36.2 28.22,36.85 28.22,38.69 PROG.P$4
  Bottom 0.305: PROG.P$4 28.21,38.06 28.96,37.31 34.16,37.31 39.5,31.98 v39.5,29.23
USB1DM
  Top 0.305: IC1.18 49.27,27.84 R1.2
USB1DP
  Top 0.305: IC1.17 47.24,27.05 49.53,24.76 R2.2
USB2DM
  Top 0.305: IC1.21 54.02,30.25 R3.2
USB2DP
  Top 0.305: IC1.20 54.02,29.44 R4.2
VIN
  Top 0.61: 69.85,52.7 67.13,52.7 65.96,51.54 60.94,51.54 C1.+
  Top 0.813: D4.C D3.C 27.94,75.82 29.03,76.91 53.47,76.91 56.44,73.94 56.44,68.83 69.83,55.45 69.83,52.73 69.85,52.7 C2.1 69.85,49.72 IC4.1
  Bottom 0.813: D4.C D3.C
XTIN
  Top 0.305: IC1.4 32.61,30.25 31.75,31.11 X1.1 30.67,34.6 C19.2
XTOUT
  Top 0.305: IC1.5 32.49,29.44 X1.2 30.67,27.62 C20.2

### Text on the board
tNames: 1
tDocu: A | B